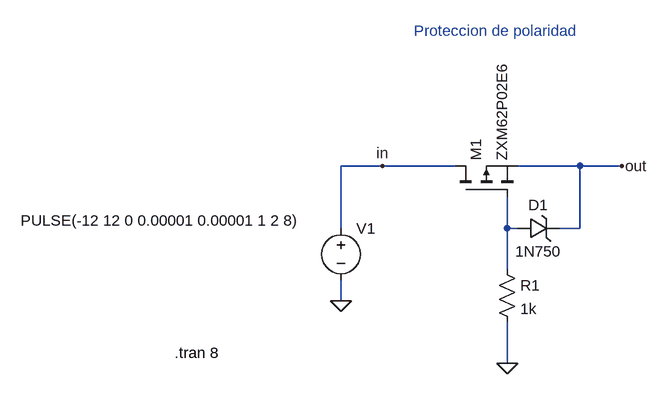
[diagram p0: schematic polarity_protec.asc]
polarity_protec.asc, the LTspice schematic file:
Version 4
SHEET 1 880 680
WIRE 272 224 208 224
WIRE 384 224 272 224
WIRE 576 224 480 224
WIRE 640 224 576 224
WIRE 208 320 208 224
WIRE 464 320 464 272
WIRE 480 320 464 320
WIRE 576 320 576 224
WIRE 576 320 544 320
WIRE 464 384 464 320
WIRE 208 432 208 400
WIRE 464 528 464 464
FLAG 640 224 out
FLAG 272 224 in
FLAG 464 528 0
FLAG 208 432 0
SYMBOL pmos 384 272 R270
SYMATTR InstName M1
SYMATTR Value ZXM62P02E6
SYMBOL Res 448 368 R0
SYMATTR InstName R1
SYMATTR Value 1k
SYMBOL zener 480 336 R270
WINDOW 0 36 32 VTop 2
WINDOW 3 -4 32 VBottom 2
SYMATTR InstName D1
SYMATTR Value 1N750
SYMBOL Voltage 208 304 R0
WINDOW 3 -493 4 Left 2
SYMATTR InstName V1
SYMATTR Value PULSE(-12 12 0 0.00001 0.00001 1 2 8)
TEXT -48 512 Left 2 !.tran 8
TEXT 320 16 Left 2 ;Proteccion de polaridad

The netlist it stands for:
* polarity_protec.asc
M1 in N001 out out ZXM62P02E6
R1 N001 0 1k
D1 N001 out 1N750
V1 in 0 PULSE(-12 12 0 0.00001 0.00001 1 2 8)
.model D D
.lib standard.dio
.model NMOS NMOS
.model PMOS PMOS
.lib standard.mos
.tran 8
* Proteccion de polaridad
.backanno
.end